# EAGLE design faulhaber-encoder (EAGLE 5.10)
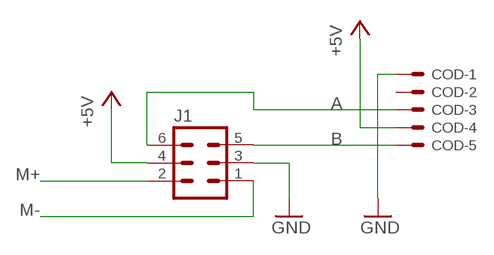
[diagram p0: schematic, sheet 1]

## Parts
COD  ED1X05  [ED1X05]
J1  ML6  [ML6]

## Nets
+5V: COD.4 J1.4
A: COD.3 J1.6
B: COD.5 J1.5
GND: COD.1 J1.3
M+: J1.2
M-: J1.1
Unconnected: COD.2

## Library data of the parts
COD = apbteam_con-amp-he14:E?1X05: Male header simple row, 5 positions
J1 = con-harting-ml:ML6: HARTING

## Board
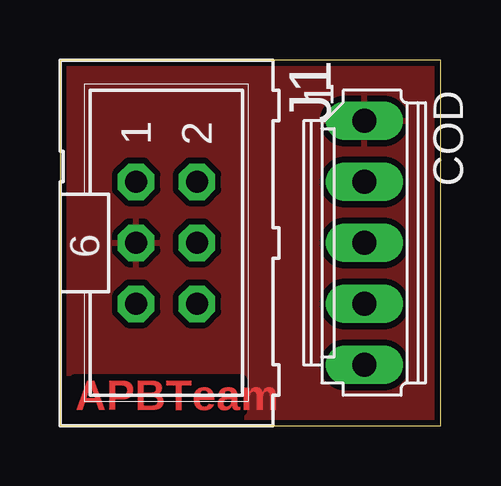
[diagram p1: board, top side]
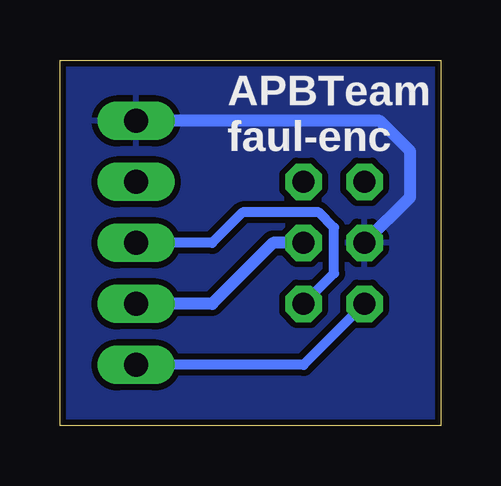
[diagram p2: board, bottom side, seen from below]

Size 15.88 x 15.24 mm. Coordinates in mm from the lower left corner, seen from the top.
Outline: 0,0 15.88,0 15.88,15.24 0,15.24 0,0
Copper layers (1*16): Top 0.035mm / dielectric 1.5mm / Bottom 0.035mm
Design rules "SparkFun": minimum track width 8mil, minimum drill 20mil, track to track 8mil, track to pad 8mil, pad to pad 8mil, via to via 8mil, smd to smd 8mil, copper to edge 10mil, drill to drill 8mil, minimum pad ring 12mil, minimum via ring 10mil, stop-mask expansion 4mil, vias tented up to drill 25mil, thermal gap 10mil

### Footprints (pad centres in the part's own frame; a part is rotated, then mirrored left to right if it is on the bottom)
ED1X05 = drill 1 long: 1 -5.08,0; 2 -2.54,0; 3 0,0; 4 2.54,0; 5 5.08,0
ML6 = drill 0.914 octagon: 1 -2.54,-1.27; 2 -2.54,1.27; 3 0,-1.27; 4 0,1.27; 5 2.54,-1.27; 6 2.54,1.27

### Placement (x,y rotation side)
COD  12.7,7.62 270 top
J1  4.45,7.62 270 top

### Tracks (layer width: path | path; a pad name or v marks a point on that pad's centre or on a via)
+5V
  Bottom 0.508: J1.4 6.99,7.62 9.53,5.08 COD.4
A
  Bottom 0.406: J1.6 4.45,6.35 4.45,8.26 5.08,8.89 8.26,8.89 9.53,7.62 COD.3
B
  Bottom 0.406: J1.5 5.71,2.54 COD.5
GND
  Bottom 0.508: COD.1 2.54,12.7 1.27,11.43 1.27,9.53 J1.3
  pour Top (isolate 0.254): 0,15.24 15.88,15.24 15.88,0 0,0
  pour Bottom (isolate 0.254): 0,15.24 15.88,15.24 15.88,0 0,0

### Text on the board
Top: APBTeam
bSilk: APBTeam | faul-enc